# Altium schematic sheet HPC_CD.SchDoc: HPC connector ROW C and ROW D
size A4; Date: 20.05.2022; ApprovedBy: PFH; CompanyName: IAM Electronic GmbH; DrawnBy: PFH; Engineer: PFH; Revision: A; SheetNumber: 3; SheetTotal: 6; Projekt: FMC Power Module; Website: www.iamelectronic.com
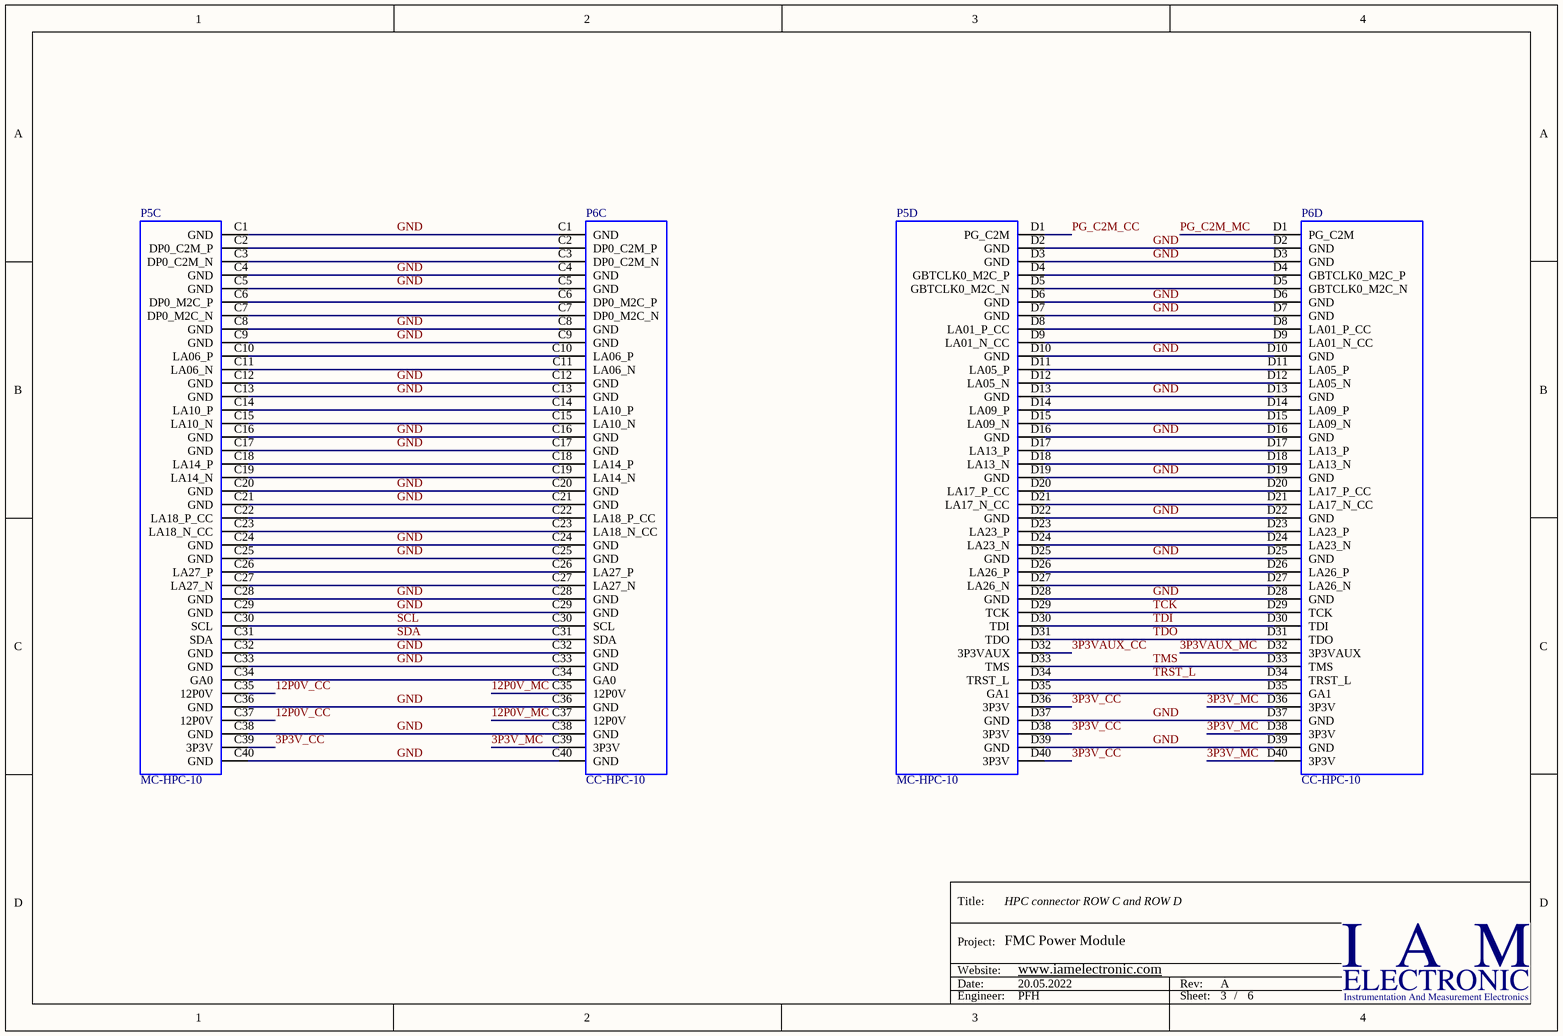
[diagram p0: HPC_CD.SchDoc]

## Parts
P5  MC-HPC-10  [ASP-134488-01]  (parts C,D of 10)
P6  CC-HPC-10  [ASP-134486-01]  (parts C,D of 10)

## Nets
3P3V_CC: P5.C39(3P3V) P5.D36(3P3V) P5.D38(3P3V) P5.D40(3P3V)
3P3V_MC: P6.C39(3P3V) P6.D36(3P3V) P6.D38(3P3V) P6.D40(3P3V)
3P3VAUX_CC: P5.D32(3P3VAUX)
3P3VAUX_MC: P6.D32(3P3VAUX)
12P0V_CC: P5.C35(12P0V) P5.C37(12P0V)
12P0V_MC: P6.C35(12P0V) P6.C37(12P0V)
GND: P5.C1(GND) P5.C4(GND) P5.C5(GND) P5.C8(GND) P5.C9(GND) P5.C12(GND) P5.C13(GND) P5.C16(GND) P5.C17(GND) P5.C20(GND) P5.C21(GND) P5.C24(GND) P5.C25(GND) P5.C28(GND) P5.C29(GND) P5.C32(GND) P5.C33(GND) P5.C36(GND) P5.C38(GND) P5.C40(GND) P5.D2(GND) P5.D3(GND) P5.D6(GND) P5.D7(GND) P5.D10(GND) P5.D13(GND) P5.D16(GND) P5.D19(GND) P5.D22(GND) P5.D25(GND) P5.D28(GND) P5.D37(GND) P5.D39(GND) P6.C1(GND) P6.C4(GND) P6.C5(GND) P6.C8(GND) P6.C9(GND) P6.C12(GND) P6.C13(GND) P6.C16(GND) P6.C17(GND) P6.C20(GND) P6.C21(GND) P6.C24(GND) P6.C25(GND) P6.C28(GND) P6.C29(GND) P6.C32(GND) P6.C33(GND) P6.C36(GND) P6.C38(GND) P6.C40(GND) P6.D2(GND) P6.D3(GND) P6.D6(GND) P6.D7(GND) P6.D10(GND) P6.D13(GND) P6.D16(GND) P6.D19(GND) P6.D22(GND) P6.D25(GND) P6.D28(GND) P6.D37(GND) P6.D39(GND)
PG_C2M_CC: P5.D1(PG_C2M)
PG_C2M_MC: P6.D1(PG_C2M)
SCL: P5.C30(SCL) P6.C30(SCL)
SDA: P5.C31(SDA) P6.C31(SDA)
TCK: P5.D29(TCK) P6.D29(TCK)
TDI: P5.D30(TDI) P6.D30(TDI)
TDO: P5.D31(TDO) P6.D31(TDO)
TMS: P5.D33(TMS) P6.D33(TMS)
TRST_L: P5.D34(TRST_L) P6.D34(TRST_L)
NetP5_C2: P5.C2(DP0_C2M_P) P6.C2(DP0_C2M_P)
NetP5_C3: P5.C3(DP0_C2M_N) P6.C3(DP0_C2M_N)
NetP5_C6: P5.C6(DP0_M2C_P) P6.C6(DP0_M2C_P)
NetP5_C7: P5.C7(DP0_M2C_N) P6.C7(DP0_M2C_N)
NetP5_C10: P5.C10(LA06_P) P6.C10(LA06_P)
NetP5_C11: P5.C11(LA06_N) P6.C11(LA06_N)
NetP5_C14: P5.C14(LA10_P) P6.C14(LA10_P)
NetP5_C15: P5.C15(LA10_N) P6.C15(LA10_N)
NetP5_C18: P5.C18(LA14_P) P6.C18(LA14_P)
NetP5_C19: P5.C19(LA14_N) P6.C19(LA14_N)
NetP5_C22: P5.C22(LA18_P_CC) P6.C22(LA18_P_CC)
NetP5_C23: P5.C23(LA18_N_CC) P6.C23(LA18_N_CC)
NetP5_C26: P5.C26(LA27_P) P6.C26(LA27_P)
NetP5_C27: P5.C27(LA27_N) P6.C27(LA27_N)
NetP5_C34: P5.C34(GA0) P6.C34(GA0)
NetP5_D4: P5.D4(GBTCLK0_M2C_P) P6.D4(GBTCLK0_M2C_P)
NetP5_D5: P5.D5(GBTCLK0_M2C_N) P6.D5(GBTCLK0_M2C_N)
NetP5_D8: P5.D8(LA01_P_CC) P6.D8(LA01_P_CC)
NetP5_D9: P5.D9(LA01_N_CC) P6.D9(LA01_N_CC)
NetP5_D11: P5.D11(LA05_P) P6.D11(LA05_P)
NetP5_D12: P5.D12(LA05_N) P6.D12(LA05_N)
NetP5_D14: P5.D14(LA09_P) P6.D14(LA09_P)
NetP5_D15: P5.D15(LA09_N) P6.D15(LA09_N)
NetP5_D17: P5.D17(LA13_P) P6.D17(LA13_P)
NetP5_D18: P5.D18(LA13_N) P6.D18(LA13_N)
NetP5_D20: P5.D20(LA17_P_CC) P6.D20(LA17_P_CC)
NetP5_D21: P5.D21(LA17_N_CC) P6.D21(LA17_N_CC)
NetP5_D23: P5.D23(LA23_P) P6.D23(LA23_P)
NetP5_D24: P5.D24(LA23_N) P6.D24(LA23_N)
NetP5_D26: P5.D26(LA26_P) P6.D26(LA26_P)
NetP5_D27: P5.D27(LA26_N) P6.D27(LA26_N)
NetP5_D35: P5.D35(GA1) P6.D35(GA1)

## Notes on the sheet
- Title:
- Project:
- Date:
- Website:
- Rev:
- Engineer:
- Sheet:
- /

## Library data of the parts
P5 = MC-HPC-10: MC-HPC-10, FMC High-pin count connector, lead free, 400 I/Os, male, 10 mm mated stack height; Manufacturer: Samtec; Manufacturer Ref: SEAM-40-03.5-S-10-2-A-K-TR-VITA57.0; Pitch: 1.27 mm; Mated Stack Height: 10 mm; Solder Type: Lead-Free; Number I/O: 400; PartName: ASP-134488-01; Part: ASP-134488-01; Vita PartNumber: MC-HPC-10; Pin Count: High; Gender: male; Supplier 1: Digi-Key; Supplier Part Number 1: SAM8730-ND
P6 = CC-HPC-10: CC-HPC-10, FMC High-pin count connector, lead free, 400 I/Os, female, 10 mm mated stack height; Manufacturer: Samtec; Manufacturer Ref: SEAF-40-06.5-10-A; Pitch: 1.27 mm; Mated Stack Height: 10 mm; Solder Type: Lead-Free; Number I/O: 400; PartName: ASP-134486-01; Part: ASP-134486-01; Vita PartNumber: CC-HPC-10; Pin Count: High; Gender: female; Supplier 1: Digi-Key; Supplier Part Number 1: SAM8728-ND